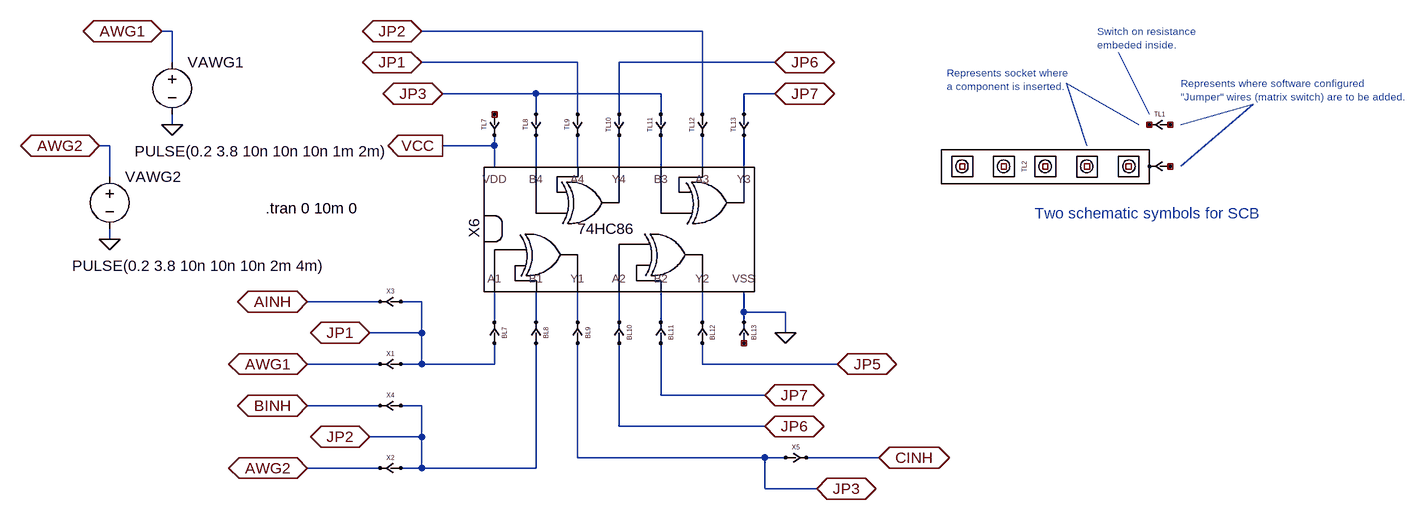
[diagram p0: schematic xor-86-test.asc]
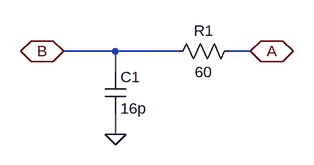
[diagram p1: sub-circuit cross_point.asc]
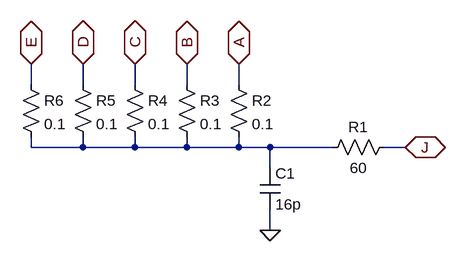
[diagram p2: sub-circuit bb_pin.asc]
xor-86-test.asc, the LTspice schematic file:
Version 4
SHEET 1 1560 680
WIRE -432 -144 -448 -144
WIRE 384 -144 -48 -144
WIRE -432 -96 -432 -144
WIRE 192 -96 -48 -96
WIRE 496 -96 256 -96
WIRE 128 -48 -16 -48
WIRE 320 -48 128 -48
WIRE 496 -48 448 -48
WIRE 128 -16 128 -48
WIRE 192 -16 192 -96
WIRE 256 -16 256 -96
WIRE 320 -16 320 -48
WIRE 384 -16 384 -144
WIRE 448 -16 448 -48
WIRE -432 0 -432 -16
WIRE -528 32 -544 32
WIRE 64 32 64 16
WIRE 64 32 -16 32
WIRE 64 64 64 32
WIRE 128 64 128 16
WIRE 192 64 192 16
WIRE 256 64 256 16
WIRE 320 64 320 16
WIRE 384 64 384 16
WIRE 448 64 448 16
WIRE -528 80 -528 32
WIRE -528 176 -528 160
WIRE -112 272 -224 272
WIRE -48 272 -80 272
WIRE 448 288 448 256
WIRE 512 288 448 288
WIRE 64 304 64 256
WIRE 128 304 128 256
WIRE 192 304 192 256
WIRE 256 304 256 256
WIRE 320 304 320 256
WIRE 384 304 384 256
WIRE 448 304 448 288
WIRE -48 320 -48 272
WIRE -48 320 -128 320
WIRE 512 320 512 288
WIRE -112 368 -224 368
WIRE -48 368 -48 320
WIRE -48 368 -80 368
WIRE 64 368 64 336
WIRE 64 368 -48 368
WIRE 384 368 384 336
WIRE 592 368 384 368
WIRE 320 416 320 336
WIRE 480 416 320 416
WIRE -112 432 -224 432
WIRE -48 432 -80 432
WIRE 256 464 256 336
WIRE 480 464 256 464
WIRE -48 480 -48 432
WIRE -48 480 -128 480
WIRE 192 512 192 336
WIRE 480 512 192 512
WIRE 512 512 480 512
WIRE 656 512 544 512
WIRE -112 528 -224 528
WIRE -48 528 -48 480
WIRE -48 528 -80 528
WIRE 128 528 128 336
WIRE 128 528 -48 528
WIRE 480 560 480 512
WIRE 560 560 480 560
FLAG -224 368 AWG1
IOPIN -224 368 BiDir
FLAG -224 528 AWG2
IOPIN -224 528 BiDir
FLAG -16 32 VCC
IOPIN -16 32 Out
FLAG 512 320 0
FLAG -128 320 JP1
IOPIN -128 320 BiDir
FLAG -128 480 JP2
IOPIN -128 480 BiDir
FLAG -48 -96 JP1
IOPIN -48 -96 BiDir
FLAG -48 -144 JP2
IOPIN -48 -144 BiDir
FLAG -224 272 AINH
IOPIN -224 272 BiDir
FLAG -224 432 BINH
IOPIN -224 432 BiDir
FLAG 560 560 JP3
IOPIN 560 560 BiDir
FLAG 656 512 CINH
IOPIN 656 512 BiDir
FLAG -16 -48 JP3
IOPIN -16 -48 BiDir
FLAG 496 -96 JP6
IOPIN 496 -96 BiDir
FLAG 480 464 JP6
IOPIN 480 464 BiDir
FLAG 592 368 JP5
IOPIN 592 368 BiDir
FLAG 496 -48 JP7
IOPIN 496 -48 BiDir
FLAG 480 416 JP7
IOPIN 480 416 BiDir
FLAG -432 0 0
FLAG -448 -144 AWG1
IOPIN -448 -144 BiDir
FLAG -528 176 0
FLAG -544 32 AWG2
IOPIN -544 32 BiDir
SYMBOL cross_point 64 320 R90
SYMATTR InstName BL7
SYMBOL cross_point 128 320 R90
SYMATTR InstName BL8
SYMBOL cross_point 192 320 R90
SYMATTR InstName BL9
SYMBOL cross_point 256 320 R90
SYMATTR InstName BL10
SYMBOL cross_point 320 320 R90
SYMATTR InstName BL11
SYMBOL cross_point 384 320 R90
SYMATTR InstName BL12
SYMBOL cross_point 448 320 R90
SYMATTR InstName BL13
SYMBOL cross_point 448 0 R270
SYMATTR InstName TL13
SYMBOL cross_point 384 0 R270
SYMATTR InstName TL12
SYMBOL cross_point 320 0 R270
SYMATTR InstName TL11
SYMBOL cross_point 256 0 R270
SYMATTR InstName TL10
SYMBOL cross_point 192 0 R270
SYMATTR InstName TL9
SYMBOL cross_point 128 0 R270
SYMATTR InstName TL8
SYMBOL cross_point 64 0 R270
SYMATTR InstName TL7
SYMBOL cross_point -96 368 R0
SYMATTR InstName X1
SYMBOL cross_point -96 528 R0
SYMATTR InstName X2
SYMBOL cross_point -96 272 R0
SYMATTR InstName X3
SYMBOL cross_point -96 432 R0
SYMATTR InstName X4
SYMBOL cross_point 528 512 M0
SYMATTR InstName X5
SYMBOL voltage -432 -112 R0
WINDOW 123 0 0 Left 0
WINDOW 39 0 0 Left 0
WINDOW 3 -58 153 Left 2
SYMATTR Value PULSE(0.2 3.8 10n 10n 10n 1m 2m)
SYMATTR InstName VAWG1
SYMBOL voltage -528 64 R0
WINDOW 123 0 0 Left 0
WINDOW 39 0 0 Left 0
WINDOW 3 -58 153 Left 2
SYMATTR Value PULSE(0.2 3.8 10n 10n 10n 2m 4m)
SYMATTR InstName VAWG2
SYMBOL BB_Pin 1008 64 R90
SYMATTR InstName TL2
SYMBOL cross_point 1088 0 R0
SYMATTR InstName TL1
SYMBOL 74hc86 272 160 R0
SYMATTR InstName X6
TEXT -288 128 Left 2 !.tran 0 10m 0
TEXT 760 -80 Left 1 ;Represents socket where\na component is inserted.
TEXT 1120 -64 Left 1 ;Represents where software configured\n"Jumper" wires (matrix switch) are to be added.
TEXT 992 -144 Left 1 ;Switch on resistance \nembeded inside.
TEXT 896 136 Left 2 ;Two schematic symbols for SCB
LINE Normal 944 -64 1056 0
LINE Normal 944 -64 976 32
LINE Normal 1232 -32 1120 0
LINE Normal 1120 64 1232 -32
LINE Normal 1024 -112 1072 -16

cross_point.asc, the sub-circuit schematic file:
Version 4
SHEET 1 880 680
WIRE 80 160 0 160
WIRE 176 160 80 160
WIRE 288 160 256 160
WIRE 80 192 80 160
WIRE 80 288 80 256
FLAG 288 160 A
IOPIN 288 160 BiDir
FLAG 0 160 B
IOPIN 0 160 BiDir
FLAG 80 288 0
SYMBOL res 272 144 R90
WINDOW 0 0 56 VBottom 2
WINDOW 3 32 56 VTop 2
SYMATTR InstName R1
SYMATTR Value 60
SYMBOL cap 64 192 R0
SYMATTR InstName C1
SYMATTR Value 16p

bb_pin.asc, the sub-circuit schematic file:
Version 4
SHEET 1 880 680
WIRE -288 64 -288 32
WIRE -208 64 -208 32
WIRE -128 64 -128 32
WIRE -48 64 -48 32
WIRE 32 64 32 32
WIRE -288 160 -288 144
WIRE -208 160 -208 144
WIRE -208 160 -288 160
WIRE -128 160 -128 144
WIRE -128 160 -208 160
WIRE -48 160 -48 144
WIRE -48 160 -128 160
WIRE 32 160 32 144
WIRE 32 160 -48 160
WIRE 80 160 32 160
WIRE 176 160 80 160
WIRE 288 160 256 160
WIRE 80 192 80 160
WIRE 80 288 80 256
FLAG 32 32 A
IOPIN 32 32 BiDir
FLAG -48 32 B
IOPIN -48 32 BiDir
FLAG 80 288 0
FLAG -128 32 C
IOPIN -128 32 BiDir
FLAG -208 32 D
IOPIN -208 32 BiDir
FLAG -288 32 E
IOPIN -288 32 BiDir
FLAG 288 160 J
IOPIN 288 160 BiDir
SYMBOL res 272 144 R90
WINDOW 0 0 56 VBottom 2
WINDOW 3 32 56 VTop 2
SYMATTR InstName R1
SYMATTR Value 60
SYMBOL cap 64 192 R0
SYMATTR InstName C1
SYMATTR Value 16p
SYMBOL res 16 48 R0
SYMATTR InstName R2
SYMATTR Value 0.1
SYMBOL res -64 48 R0
SYMATTR InstName R3
SYMATTR Value 0.1
SYMBOL res -144 48 R0
SYMATTR InstName R4
SYMATTR Value 0.1
SYMBOL res -224 48 R0
SYMATTR InstName R5
SYMATTR Value 0.1
SYMBOL res -304 48 R0
SYMATTR InstName R6
SYMATTR Value 0.1

The netlist it stands for:
* xor-86-test.asc
XBL7 JP1 N007 cross_point
XBL8 JP2 N008 cross_point
XBL9 JP3 N009 cross_point
XBL10 JP6 N010 cross_point
XBL11 JP7 N011 cross_point
XBL12 JP5 N012 cross_point
XBL13 NC_01 0 cross_point
XTL13 JP7 N006 cross_point
XTL12 JP2 N005 cross_point
XTL11 JP3 N004 cross_point
XTL10 JP6 N003 cross_point
XTL9 JP1 N002 cross_point
XTL8 JP3 N001 cross_point
XTL7 NC_02 VCC cross_point
XX1 JP1 AWG1 cross_point
XX2 JP2 AWG2 cross_point
XX3 JP1 AINH cross_point
XX4 JP2 BINH cross_point
XX5 JP3 CINH cross_point
VAWG1 AWG1 0 PULSE(0.2 3.8 10n 10n 10n 1m 2m)
VAWG2 AWG2 0 PULSE(0.2 3.8 10n 10n 10n 2m 4m)
XTL2 NC_03 NC_04 NC_05 NC_06 NC_07 NC_08 bb_pin
XTL1 NC_09 NC_10 cross_point
XX6 N007 N008 N009 N010 N011 N012 0 N006 N005 N004 N003 N002 N001 VCC 74HC86  ; pins A1 B1 Y1 A2 B2 Y2 VSS Y3 A3 B3 Y4 A4 B4 VDD

* block symbol definitions
.subckt cross_point A B
R1 A B 60
C1 B 0 16p
.ends cross_point

.subckt bb_pin J A B C D E
R1 J N001 60
C1 N001 0 16p
R2 A N001 0.1
R3 B N001 0.1
R4 C N001 0.1
R5 D N001 0.1
R6 E N001 0.1
.ends bb_pin

.tran 0 10m 0
* Represents socket where
* a component is inserted.
* Represents where software configured
* "Jumper" wires (matrix switch) are to be added.
* Switch on resistance
* embeded inside.
* Two schematic symbols for SCB
.backanno
.end